# Altium schematic sheet dcdc_converter.SchDoc
size A3; SheetNumber: 15; SheetTotal: 15; SheetDescription: DC/DC
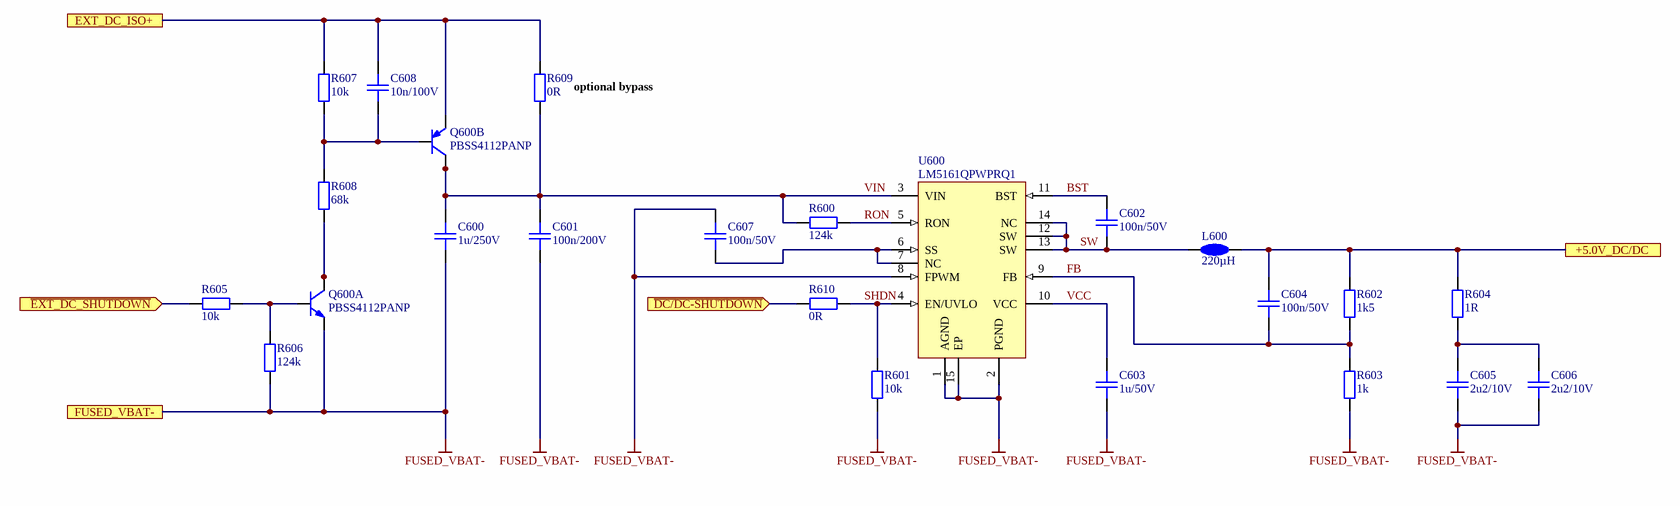
[diagram p0: dcdc_converter.SchDoc]

## Parts
C600  1u/250V  [CAPC4532X16N]
C601  100n/200V  [CAPC3216X18N]
C602  100n/50V  [CAPC1608X08N]
C603  1u/50V  [CAPC2012X14N]
C604  100n/50V  [CAPC1608X08N]
C605  2u2/10V  [CAPC2012X14N]
C606  2u2/10V  [CAPC2012X14N]
C607  100n/50V  [CAPC1608X08N]
C608  10n/100V  [CAPC1608X08N]
L600  220µH  [TYS6045221M-10]
Q600  PBSS4112PANP  [PBSS4112PANP]  (parts A,B of 2)
R600  124k  [RESC1608X05N]
R601  10k  [RESC1608X05N]
R602  1k5  [RESC1608X05N]
R603  1k  [RESC1608X05N]
R604  1R  [RESC2012X05N]
R605  10k  [RESC1608X05N]
R606  124k  [RESC1608X05N]
R607  10k  [RESC1608X05N]
R608  68k  [RESC1608X05N]
R609  0R  [RESC1608X05N]
R610  0R  [RESC1608X05N]
U600  LM5161QPWPRQ1  [PWP0014A]

## Ports
+5.0V_DC/DC, EXT_DC_ISO+, FUSED_VBAT-, ~{DC/DC-SHUTDOWN} (in), ~{EXT_DC_SHUTDOWN} (in)

## Nets
FUSED_VBAT-: C600.1 C601.1 C603.1 C605.1 C606.1 C607.2 Q600.1(E) R601.2 R603.2 R606.1 U600.1(AGND) U600.2(PGND) U600.8(FPWM) U600.15(EP) ; port FUSED_VBAT-
+5.0V_DC/DC: C604.2 L600.2 R602.1 R604.1 ; port +5.0V_DC/DC
~{DC/DC-SHUTDOWN}: R610.2 ; port ~{DC/DC-SHUTDOWN}
~{EXT_DC_SHUTDOWN}: R605.1 ; port ~{EXT_DC_SHUTDOWN}
BST: C602.2 U600.11(BST)
EXT_DC_ISO+: C608.1 Q600.4(E) R607.2 R609.2 ; port EXT_DC_ISO+
FB: C604.1 R602.2 R603.1 U600.9(FB)
RON: R600.1 U600.5(RON)
SHDN: R601.1 R610.1 U600.4(EN/UVLO)
SW: C602.1 L600.1 U600.12(SW) U600.13(SW) U600.14(NC)
VCC: C603.2 U600.10(VCC)
VIN: C600.2 C601.2 Q600.3(C) Q600.8(C) R600.2 R609.1 U600.3(VIN)
NetC605_2: C605.2 C606.2 R604.2
NetC607_1: C607.1 U600.6(SS) U600.7(NC)
NetC608_2: C608.2 Q600.5(B) R607.1 R608.2
NetQ600_2: Q600.2(B) R605.2 R606.2
NetQ600_6: Q600.6(C) Q600.7(C) R608.1

## Notes on the sheet
- (near R609) optional bypass
- Fraunhofer IISB
- Schottkystr. 10
- developed by:
- 91058 Erlangen
- Germany
- Author
- Project
- License
- Description
- File
- Version
- Release Date
- Sheet
- foxbms.org <https://foxbms.org>
- www.iisb.fraunhofer.de <https://www.iisb.fraunhofer.de/>
- foxBMS Team
- /

## Library data of the parts
C600 = gen_C_ceramic_1u_250V_X7R_1812: MLCC; Capacitance: 1u; Rated Voltage: 250V; Dielectric: X7T; Case EIA: 1812; Case Metric: 4532; Automotive Qualified: True; Part Number: gen_C_ceramic_1u_250V_X7R_1812; Supplier 1: Farnell; Supplier Part Number 1: 2435499
C601 = gen_C_ceramic_100n_200V_X7R_1206: MLCC; Capacitance: 100n; Rated Voltage: 200V; Dielectric: X7R; Case EIA: 1206; Case Metric: 3216; Automotive Qualified: True; Part Number: gen_C_ceramic_100n_200V_X7R_1206; Supplier 1: Farnell; Supplier Part Number 1: 2673161; Supplier 2: Farnell; Supplier Part Number 2: 2520773
C602 C604 C607 = gen_C_ceramic_100n_50V_X7R_0603: MLCC; Capacitance: 100n; Rated Voltage: 50V; Dielectric: X7R; Case EIA: 0603; Case Metric: 1608; PnP Package: C_0603_10; PnP Value: 100n/50V/X7R; PnP equipped: x; Automotive Qualified: True; Part Number: gen_C_ceramic_100n_50V_X7R_0603; Supplier 1: Farnell; Supplier Part Number 1: 2525267; Supplier 2: Digikey; Supplier Part Number 2: 490-6049-1-ND; Supplier 3: Farnell; Supplier Part Number 3: 2070398
C603 = gen_C_ceramic_1u_50V_X7R_0805: MLCC; Capacitance: 1u; Rated Voltage: 50V; Dielectric: X7R; Case EIA: 0805; Case Metric: 2012; Automotive Qualified: True; Tolerance: ± 10%; AVT Set: x; Part Number: gen_C_ceramic_1u_50V_X7R_0805; Supplier 1: Farnell; Supplier Part Number 1: 2672199; Operating Temperature: -55°C - +125°C; Supplier 2: Farnell; Supplier Part Number 2: 2479894; Supplier 3: Farnell; Supplier Part Number 3: 2464630
C605 C606 = gen_C_ceramic_2u2_10V_X7R_0805: MLCC; Capacitance: 2u2; Rated Voltage: 10V; Dielectric: X7R; Case EIA: 0805; Case Metric: 2012; Automotive Qualified: True; Part Number: gen_C_ceramic_2u2_10V_X7R_0805; Supplier 1: Farnell; Supplier Part Number 1: 2478259; Supplier 2: Farnell; Supplier Part Number 2: 2070513
C608 = gen_C_ceramic_10n_100V_X7R_0603: MLCC; Capacitance: 10n; Rated Voltage: 100V; Dielectric: X7R; Case EIA: 0603; Case Metric: 1608; Automotive Qualified: True; Part Number: gen_C_ceramic_10n_100V_X7R_0603; Supplier 1: Farnell; Supplier Part Number 1: 1301715; Supplier 2: Farnell; Supplier Part Number 2: 2821192; Supplier 3: Farnell; Supplier Part Number 3: 2210878
L600 = TYS6045221M-10: Power Inductor; Manufacturer: Laird-Signal Integrity Products; Rated Current: 590mA; Saturation Current: 700mA; Automotive Qualified: True; Part Number: TYS6045221M-10; Operating Temperature: -55°C - +150°C; ComponentLink1Description: Datasheet; ComponentLink1URL: http://assets.lairdtech.com/home/brandworld/files/TYS6045221M-10.pdf; Inductance: 220µH; Supplier 1: Digikey; Supplier Part Number 1: 240-2742-1-ND
Q600 = PBSS4112PANP: Dual NPN/PNP Transistor; Part Name: DUAL PNP/NPN; Manufacturer: Nexperia; Maximum Drain-Source Voltage: 120V; Maximum Continous Drain Current (25°C): 1A; Automotive Qualified: True; Part Number: PBSS4112PANP; Operating Temperature: -55°C - +150°C; ComponentLink1Description: Datasheet; ComponentLink1URL: https://assets.nexperia.com/documents/data-sheet/PBSS4112PANP.pdf; Supplier 2: Digikey; Supplier Part Number 2: 1727-1068-1-ND; Supplier 3: Mouser; Supplier Part Number 3: 771-PBSS4112PANP
R600 R606 = gen_R_124k_0603: SMD Resistor 124k 0603; Tolerance: 1%; Power: 0.1W; Case EIA: 0603; Case Metric: 1608; Maximum Working Voltage: 75V; PnP Package: R_0603; Automotive Qualified: True; Part Number: gen_R_124k_0603; Operating Temperature: -55°C - +155°C; Resistance: 124k; Series: E96; PnP Value: 124k; Supplier 1: Farnell; Supplier Part Number 1: 2138508
R601 R605 R607 = gen_R_10k_0603: SMD Resistor 10k 0603; Tolerance: 1%; Power: 0.1W; Case EIA: 0603; Case Metric: 1608; Maximum Working Voltage: 75V; PnP Package: R_0603; Automotive Qualified: True; Part Number: gen_R_10k_0603; Operating Temperature: -55°C - +155°C; Resistance: 10k; Series: E24, E96; PnP Value: 10k; Supplier 1: Farnell; Supplier Part Number 1: 2073349
R602 = gen_R_1k5_0603: SMD Resistor 1k5 0603; Tolerance: 1%; Power: 0.1W; Case EIA: 0603; Case Metric: 1608; Maximum Working Voltage: 75V; PnP Package: R_0603; Automotive Qualified: True; Part Number: gen_R_1k5_0603; Operating Temperature: -55°C - +155°C; Resistance: 1k5; Series: E24, E96; PnP Value: 1k5; Supplier 1: Farnell; Supplier Part Number 1: 2616745
R603 = gen_R_1k_0603: SMD Resistor 1k 0603; Tolerance: 1%; Power: 0.1W; Case EIA: 0603; Case Metric: 1608; Maximum Working Voltage: 75V; PnP Package: R_0603; Automotive Qualified: True; PnP equipped: x; Part Number: gen_R_1k_0603; Operating Temperature: -55°C - +155°C; Resistance: 1k; Series: E24, E96; PnP Value: 1k; Supplier 1: Farnell; Supplier Part Number 1: 1652848
R604 = gen_R_1R_0805: SMD Resistor 1R 0805; Tolerance: 1%; Power: 0.125W; Case EIA: 0805; Case Metric: 2012; Maximum Working Voltage: 150V; PnP Package: R_0805; Automotive Qualified: True; Part Number: gen_R_1R_0805; Operating Temperature: -55°C - +155°C; Resistance: 1R; Series: E24, E96; PnP Value: 1R; Supplier 1: Farnell; Supplier Part Number 1: 2616757
R608 = gen_R_68k_0603: SMD Resistor 68k 0603; Tolerance: 1%; Power: 0.1W; Case EIA: 0603; Case Metric: 1608; Maximum Working Voltage: 75V; PnP Package: R_0603; Automotive Qualified: False; Part Number: gen_R_68k_0603; Operating Temperature: -55°C - +155°C; Resistance: 68k; Series: E24; PnP Value: 68k
R609 R610 = gen_R_0R_0603: SMD Resistor 0R 0603; Power: 0.1W; Case EIA: 0603; Case Metric: 1608; Maximum Working Voltage: 75V; PnP Package: R_0603; Automotive Qualified: True; Part Number: gen_R_0R_0603; Operating Temperature: -55°C - +155°C; Resistance: 0R; Series: Jumper; PnP Value: 0R; Supplier 1: Farnell; Supplier Part Number 1: 2616580
U600 = LM5161QPWPRQ1: Automotive DC/DC buck converter; Manufacturer: Texas Instruments; PnP Package: HTSSOP-14; Automotive Qualified: True; Part Number: LM5161QPWPRQ1; Part Name: LM5161QPWPRQ1; Operating Temperature: −40°C - +125°C; Supplier 1: Digikey; Supplier Part Number 1: 296-47791-1-ND; Supplier 2: Mouser; Supplier Part Number 2: 595-LM5161QPWPRQ1